# EAGLE design PID MPS (EAGLE 9.6.2)
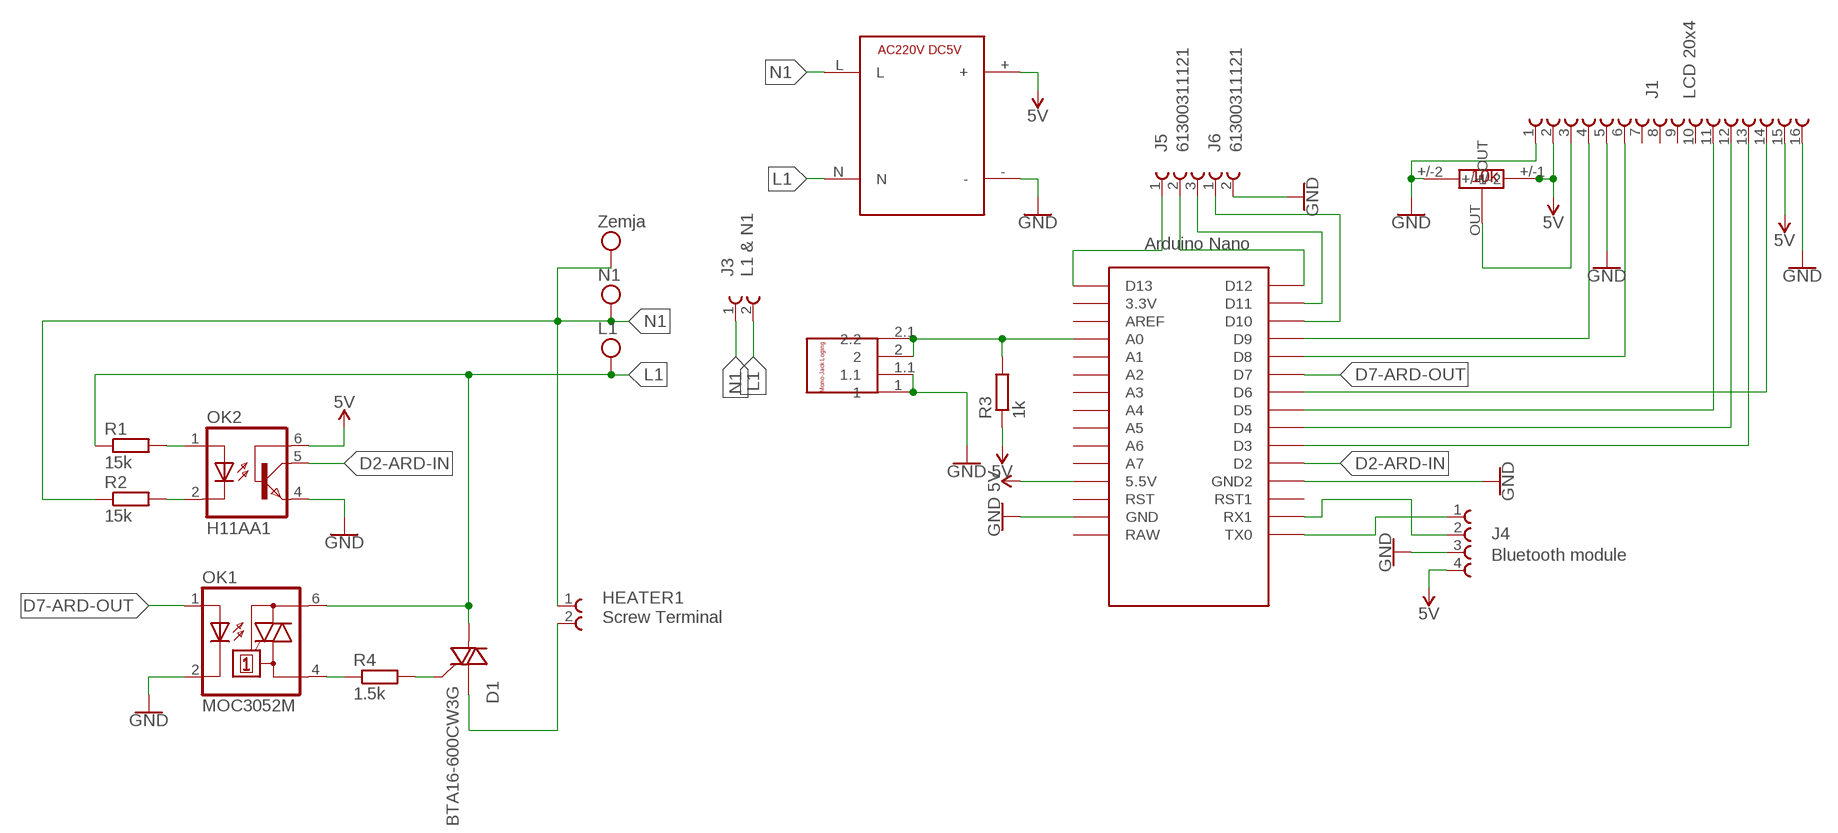
[diagram p0: schematic, sheet 1]

## Parts
D1  BTA16-600CW3G  [TO254P1028X482X1968-3]
HEATER1  Screw Terminal  691102710002  [691102710002]
J1  LCD 20x4  61301611121  [61301611121]
J3  L1 & N1  691102710002  [691102710002]
J4  Bluetooth module  61300411121  [61300411121]
J5  61300311121  [61300311121]
J6  61300311121  [61300311121]
OK1  MOC3052M  MOC3042M  [DIL06]
OK2  H11AA1  H11A1M  [DIL06]
R1  15k  R0207/10  [0207/10]
R2  15k  R0207/10  [0207/10]
R3  1k  R0207/10  [0207/10]
R4  1.5k  R0207/10  [0207/10]
U$1  NANO  [NANO]
U$2  AC220V-DC5V220V-5VALIEXPESS  [220AC-5DC]
U$3  POTENCIOMETAR-GACPOTENCIOMETAR-GAC  [POTENCIOMETAR-GAC]
U$4  MONO-JACK-LOGING  [MONO-JACK-LOGING]

## Nets
5V: J1.2 J1.15 J4.4 OK2.6(BAS) R3.1 U$1.5V(5.5V) U$2.+ U$3.+/-1
D2-ARD-IN: OK2.5(COL) U$1.D2
D7-ARD-OUT: OK1.1(A) U$1.D7
GND: J1.1 J1.5 J1.16 J4.3 J6.2 OK1.2(C) OK2.4(EMI) U$1.GND U$1.GND1(GND2) U$2.- U$3.+/-2 U$4.1 U$4.1.1
L1 [power]: D1.2(MT2) J3.2 OK1.6(A2) R1.1 U$2.N
N1 [power]: HEATER1.1 J3.1 R2.1 U$2.L ; supply symbol labelled Zemja
N$1 [power]: OK2.1(A) R1.2
N$2 [power]: OK2.2(C) R2.2
N$3 [power]: OK1.4(A1) R4.1
N$4 [power]: D1.3(G) R4.2
N$5: J1.4 U$1.D9
N$6 [power]: D1.1(MT1) HEATER1.2
N$7: J1.6 U$1.D8
N$8: J1.11 U$1.D5
N$9: J1.12 U$1.D4
N$10: J1.13 U$1.D3
N$11: J1.14 U$1.D6
N$13: J1.3 U$3.OUT
N$14: J4.1 U$1.TX0
N$15: J4.2 U$1.RX1
N$16: J5.1 U$1.D13
N$17: J5.2 U$1.D12
N$18: J5.3 U$1.D11
N$19: J6.1 U$1.D10
N$22: R3.2 U$1.A0 U$4.2 U$4.2.1(2.2)
Unconnected: J1.7 J1.8 J1.9 J1.10 U$1.3.3V U$1.A1 U$1.A2 U$1.A3 U$1.A4 U$1.A5 U$1.A6 U$1.A7 U$1.AREF U$1.ICSP1 U$1.ICSP2 U$1.ICSP3 U$1.ICSP4 U$1.ICSP5 U$1.ICSP6 U$1.RAW U$1.RST U$1.RST1

## Library data of the parts
D1 = BTA16-600CW3G:BTA16-600CW3G: Thyristor TRIAC 600V 170A 3-Pin(3+Tab) TO-220AB Tube; AVAILABILITY: Unavailable; DESCRIPTION: Thyristor TRIAC 600V 170A 3-Pin_3+Tab_ TO-220AB Tube; MF: Littelfuse Inc.; MP: BTA16-600CW3G; PACKAGE: TO-220 Littelfuse; PRICE: None
HEATER1 J3 = Screw Terminal Block (2pin):691102710002: ConTBL SERIE 102 - 5.0MM HORIZONTAL ENTRY WITH PRESSURE CLAMP - 1.5MM² WIRES WR-TBL, 2 Pins=>Code : Con_TBL_Screw_PressureClamp_691102710002 <http://katalog.we-online.de/media/images/eican/Con_TBL_Screw_PressureClamp_6911027100xx_pf2.jpg> Details see: http://katalog.we-online.de/en/em/691_102_710_0xx Created 2014-06-17, Karrer Zheng 2014 (C) Würth Elektronik; AVAILABILITY: Good; DESCRIPTION: 102 Series 5mm Pitch Straight, PCB Terminal Block, Through Hole, 2 Way; MF: Wurth Electronics; MP: 691102710002; PACKAGE: None; PRICE: 0.72 USD
J1 = 61301611121 Letvici (cesel 16pin):61301611121: WR-PHD 2.54mm Pin Header, 16 Pins =>Code : Con_BTB_PHD_2.54_1_THT_61301611121 <http://katalog.we-online.de/media/images/eican/Con_BTB_PHD_2.54_1_THT_6130xx11121_pf2.jpg> Details see: http://katalog.we-online.de/en/em/613_0xx_111_21 Created 2014-05-29, Karrer Zheng 2014 (C) Würth Elektronik; AVAILABILITY: Good; DESCRIPTION: Board-To-Board Connector, Vertical, WR-PHD Series, Through Hole, Header, 16, 2.54 mm; MF: Wurth Electronics; MP: 61301611121; PACKAGE: None; PRICE: 0.60 USD
J4 = 61300811121 Letvici (cesel 4pin):61300411121: WR-PHD 2.54mm Pin Header, 4 Pin =>Code : Con_BTB_PHD_2.54_1_THT_61300411121 <http://katalog.we-online.de/media/images/eican/Con_BTB_PHD_2.54_1_THT_6130xx11121_pf2.jpg> Details see: http://katalog.we-online.de/en/em/613_0xx_111_21 Created 2014-05-29, Karrer Zheng 2014 (C) Würth Elektronik; AVAILABILITY: Good; DESCRIPTION: Board-To-Board Connector, Vertical, WR-PHD Series, Through Hole, Header, 4, 2.54 mm; MF: Wurth; MP: 61300411121; PACKAGE: None; PRICE: 0.11 USD
J5 = 61300311121 Letvici (cesel 3pin):61300311121: WR-PHD 5.54mm Pin Header, 3 Pin =>Code : Con_BTB_PHD_2.54_1_THT_61300311121 <http://katalog.we-online.de/media/images/eican/Con_BTB_PHD_2.54_1_THT_6130xx11121_pf2.jpg> Details see: http://katalog.we-online.de/en/em/613_0xx_111_21 Created 2014-05-29, Karrer Zheng 2014 (C) Würth Elektronik; AVAILABILITY: Unavailable; DESCRIPTION: Board-To-Board Connector, Vertical, WR-PHD Series, Through Hole, Header, 3, 2.54 mm; MF: Wurth Electronics; MP: 61300311121; PACKAGE: None; PRICE: None
J6 = 61300311121 Letvici (cesel 2pin):61300311121: WR-PHD 5.54mm Pin Header, 3 Pin =>Code : Con_BTB_PHD_2.54_1_THT_61300311121 <http://katalog.we-online.de/media/images/eican/Con_BTB_PHD_2.54_1_THT_6130xx11121_pf2.jpg> Details see: http://katalog.we-online.de/en/em/613_0xx_111_21 Created 2014-05-29, Karrer Zheng 2014 (C) Würth Elektronik; AVAILABILITY: Unavailable; DESCRIPTION: Board-To-Board Connector, Vertical, WR-PHD Series, Through Hole, Header, 3, 2.54 mm; MF: Wurth Electronics; MP: 61300311121; PACKAGE: None; PRICE: None
OK1 = optocoupler:MOC30*: 6-Pin DIP Zero-Cross Optoisolators Triac Driver Output (250/400 Volt Peak) Source: http://www.fairchildsemi.com/ds/MO/MOC3043-M.pdf; MF: FAIRCHILD SEMICONDUCTOR; MPN: MOC3042-M; OC_FARNELL: 1021368; OC_NEWARK: 72K8899
OK2 = optocoupler:H11A*?M: General Purpose 6-Pin Phototransistor Optocouplers Source: http://www.fairchildsemi.com/ds/4N/4N35-M.pdf; MPN: H11A1-M; OC_FARNELL: 1021358; OC_NEWARK: 97K1793
R1-R4 = eagle-ltspice:R: RESISTOR, European symbol; SPICEMODEL: NONE; SPICEPREFIX: R
U$1 = Arduino-clone:NANO: Arduino Nano
U$2 = AC220V - DC5V:AC220V-DC5V
U$3 = Potenciometar 10kOhm GAC el.:POTENCIOMETAR-GAC
U$4 = Mono-Jack Loging:MONO-JACK-LOGING

## Net classes
0 default: width 0.5 mm, drill 1 mm, clearance 0.5 mm
1 power: width 1.6 mm, drill 1 mm, clearance 1 mm

## Board
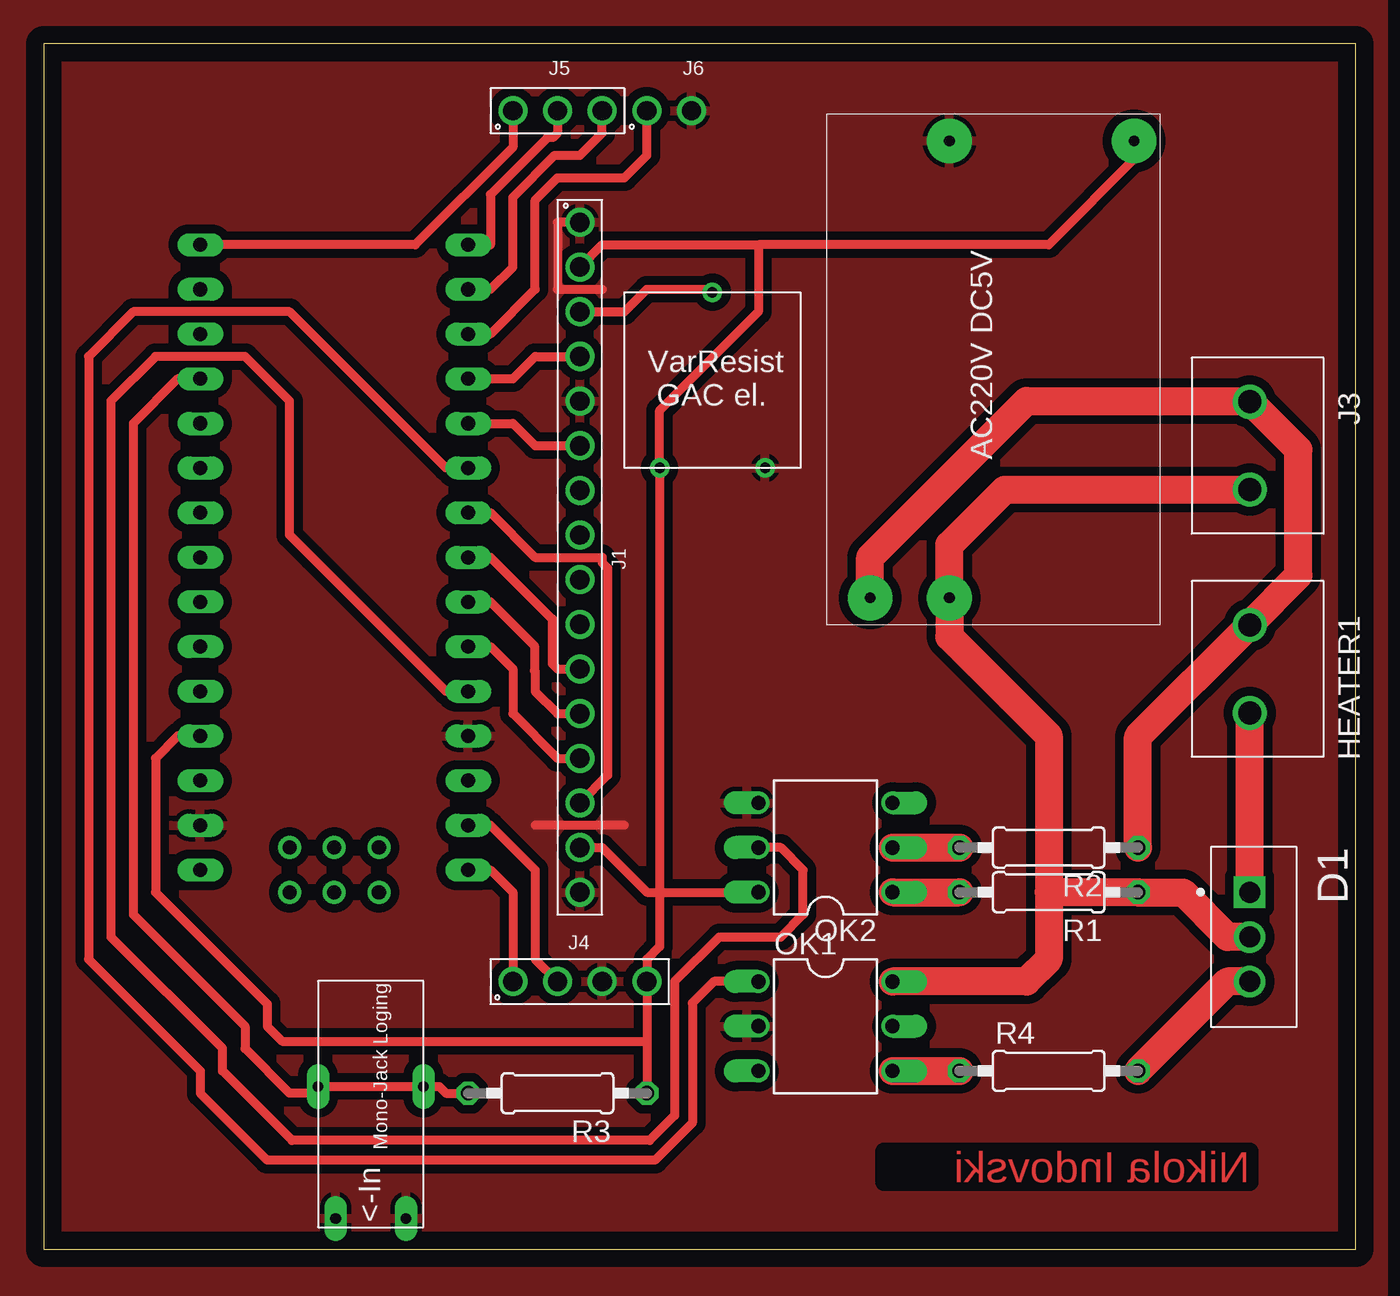
[diagram p1: board, top side]

Size 74.6 x 68.57 mm. Coordinates in mm from the lower left corner, seen from the top.
Outline: 0,0 74.6,0 74.6,68.57 0,68.57 0,0
Copper layers (1*16): Top 0.035mm / dielectric 1.5mm / Bottom 0.035mm
Design rules "default": minimum track width 6mil, minimum drill 0.35mm, track to track 6mil, track to pad 6mil, pad to pad 6mil, via to via 6mil, smd to smd 6mil, copper to edge 40mil, drill to drill 6mil, minimum pad ring 10mil, minimum via ring 8mil, stop-mask expansion 4mil, vias tented up to drill 0mil, thermal gap 10mil

### Footprints (pad centres in the part's own frame; a part is rotated, then mirrored left to right if it is on the bottom)
TO254P1028X482X1968-3 = drill 1.19 pad 1.79 square: 1 0,0 | drill 1.19 pad 1.79: 2 2.54,0; 3 5.08,0
691102710002 = drill 1.3: 1 -2.5,0; 2 2.5,0
61301611121 = drill 1.1: 1 -19.05,0; 2 -16.51,0; 3 -13.97,0; 4 -11.43,0; 5 -8.89,0; 6 -6.35,0; 7 -3.81,0; 8 -1.27,0; 9 1.27,0; 10 3.81,0; 11 6.35,0; 12 8.89,0; 13 11.43,0; 14 13.97,0; 15 16.51,0; 16 19.05,0
61300411121 = drill 1.1: 1 -3.81,0; 2 -1.27,0; 3 1.27,0; 4 3.81,0
61300311121 = drill 1.1: 1 -2.54,0; 2 0,0; 3 2.54,0
61300311121' = drill 1.1: 1 -2.54,0; 2 0,0
DIL06 = drill 0.813 offset: 1 -2.54,-3.81; 2 0,-3.81; 3 2.54,-3.81; 4 2.54,3.81; 5 0,3.81; 6 -2.54,3.81
0207/10 = drill 0.813 octagon: 1 -5.08,0; 2 5.08,0
NANO = drill 0.8 long: 3.3V -10.16,24.13; 5V -10.16,-1.27; A0 -10.16,19.05; A1 -10.16,16.51; A2 -10.16,13.97; A3 -10.16,11.43; A4 -10.16,8.89; A5 -10.16,6.35; A6 -10.16,3.81; A7 -10.16,1.27; AREF -10.16,21.59; D2 5.08,1.27; D3 5.08,3.81; D4 5.08,6.35; D5 5.08,8.89; D6 5.08,11.43; D7 5.08,13.97; D8 5.08,16.51; D9 5.08,19.05; D10 5.08,21.59; D11 5.08,24.13; D12 5.08,26.67; D13 -10.16,26.67; GND -10.16,-6.35; GND1 5.08,-1.27; RAW -10.16,-8.89; RST -10.16,-3.81; RST1 5.08,-3.81; RX1 5.08,-6.35; TX0 5.08,-8.89 | drill 0.8: ICSP1 -5.08,-10.16; ICSP2 -5.08,-7.62; ICSP3 -2.54,-10.16; ICSP4 -2.54,-7.62; ICSP5 0,-10.16; ICSP6 0,-7.62
220AC-5DC = drill 0.6 pad 2.54: + 27.5,1.5; - 27.5,12; L 1.5,16.5; N 1.5,12
POTENCIOMETAR-GAC = drill 0.6: +/-1 2,0; +/-2 8,0; OUT 5,10
MONO-JACK-LOGING = drill 0.6 pad 1.27 long: 1 0.5,5; 1.1 0.5,1; 2 8,6; 2.1 8,0

### Placement (x,y rotation side)
D1  68.58,20.32 270 top
HEATER1  68.58,33.02 270 top
J1  30.48,39.37 270 top
J3  68.58,45.72 270 top
J4  30.48,15.24 0 top
J5  29.21,64.77 0 top
J6  61300311121  [61300311121']  36.83,64.77 0 top
OK1  44.45,12.7 270 top
OK2  44.45,22.86 90 top
R1  57.15,20.32 180 top
R2  57.15,22.86 180 top
R3  29.21,8.89 180 top
R4  57.15,10.16 0 top
U$1  19.05,30.48 0 top
U$2  63.5,35.56 90 top
U$3  33.02,44.45 0 top
U$4  21.59,1.27 90 top

### Tracks (layer width: path | path; a pad name or v marks a point on that pad's centre or on a via)
5V
  Top 0.5: 35.25,44.23 U$3.+/-1
  Top 0.508: U$1.5V 7.62,29.21 6.35,27.94 6.35,20.32 12.7,13.97 12.7,12.7 13.55,11.85 34.29,11.85 | 34.29,11.85 J4.4 34.29,16.51 35.02,17.24 35.02,20.32 | 34.29,11.85 R3.1 | 35.02,20.32 OK2.6 | J1.15 31.75,22.86 34.29,20.32 35.02,20.32 | J1.2 31.75,57.15 40.64,57.15 | U$2.+ 62.23,62.83 62.23,62.23 57.15,57.15 40.64,57.15 | 40.64,57.15 40.64,53.34 35.02,47.72 U$3.+/-1 35.02,20.32
D2-ARD-IN
  Top 0.508: U$1.D2 22.86,31.75 15.24,39.37 13.97,40.64 13.97,48.26 11.43,50.8 6.35,50.8 3.81,48.26 3.81,17.78 10.16,11.43 10.16,10.16 14.11,6.21 34.45,6.21 35.87,7.62 35.87,15.24 38.41,17.78 41.91,17.78 43.18,19.05 43.18,21.59 41.91,22.86 OK2.5
D7-ARD-OUT
  Top 0.508: OK1.1 38.1,15.24 36.88,14.02 36.88,7.2 34.76,5.08 12.7,5.08 8.89,8.89 8.89,10.16 2.54,16.51 2.54,50.8 5.08,53.34 13.97,53.34 22.86,44.45 U$1.D7
GND
  Top 0.508: 33.02,24.13 27.94,24.13 | J1.1 29.21,58.42 29.21,54.61 31.75,54.61
  pour Top: -1.27,69.85 -1.27,-1.27 74.93,-1.27 74.93,69.85
L1
  Top 1.524: 62.23,20.3 62.25,20.3
  Top 1.6: J3.2 54.65,43.22 51.5,40.07 U$2.N 51.5,34.86 57.15,29.21 57.15,20.32 | OK1.6 55.88,15.24 57.15,16.51 57.15,20.32 | 57.15,20.32 R1.1 62.25,20.3 64.79,20.3 67.31,17.78 D1.2
N1
  Top 1.6: U$2.L 46.99,39.37 55.88,48.26 68.54,48.26 J3.1 68.62,48.22 71.36,45.48 71.36,38.34 68.58,35.56 HEATER1.1 62.23,29.17 R2.1
N$1
  Top 1.6: OK2.1 R1.2
N$2
  Top 1.6: OK2.2 R2.2
N$3
  Top 1.6: OK1.4 R4.1
N$4
  Top 1.6: D1.3 67.31,15.24 R4.2
N$5
  Top 0.508: U$1.D9 26.67,49.53 27.94,50.8 J1.4
N$6
  Top 1.6: D1.1 HEATER1.2
N$7
  Top 0.508: U$1.D8 26.67,46.99 27.94,45.72 J1.6
N$8
  Top 0.508: U$1.D5 25.4,39.37 28.9,35.87 28.9,33.33 29.21,33.02 J1.11
N$9
  Top 0.508: U$1.D4 25.4,36.83 27.89,34.34 27.89,32.91 27.94,32.86 27.94,31.75 29.21,30.48 J1.12
N$10
  Top 0.508: U$1.D3 25.4,34.29 26.67,33.02 26.67,30.48 29.21,27.94 J1.13
N$11
  Top 0.508: J1.14 32.06,26.98 32.06,38.75 31.75,39.06 31.75,39.37 27.94,39.37 25.4,41.91 U$1.D6
N$13
  Top 0.508: U$3.OUT 37.86,54.61 34.29,54.61 33.02,53.34 J1.3
N$14
  Top 0.508: U$1.TX0 25.4,21.59 26.67,20.32 J4.1
N$15
  Top 0.508: U$1.RX1 25.4,24.13 27.94,21.59 27.94,16.51 J4.2
N$16
  Top 0.508: J5.1 26.67,62.7 21.12,57.15 U$1.D13
N$17
  Top 0.508: J5.2 29.21,63.5 28.95,63.24 28.64,63.24 25.4,60 25.4,57.15 U$1.D12
N$18
  Top 0.508: U$1.D11 25.4,54.61 26.67,55.88 26.67,59.85 29.05,62.23 30.48,62.23 31.75,63.5 J5.3
N$19
  Top 0.508: J6.1 34.29,62.23 33.02,60.96 29.21,60.96 27.94,59.69 27.94,54.61 25.4,52.07 U$1.D10
N$20
  pour Top: -2.54,71.12 -2.54,-2.54 76.2,-2.54 76.2,71.12
N$22
  Top 0.508: R3.2 22.86,8.89 22.48,9.27 U$4.2.1 U$4.2 15.21,8.89 13.97,8.89 11.43,11.43 11.43,12.7 5.08,19.05 5.08,46.99 7.62,49.53 U$1.A0

### Text on the board
Top: Nikola Indovski